# Altium project fleischerTow.PrjPCB
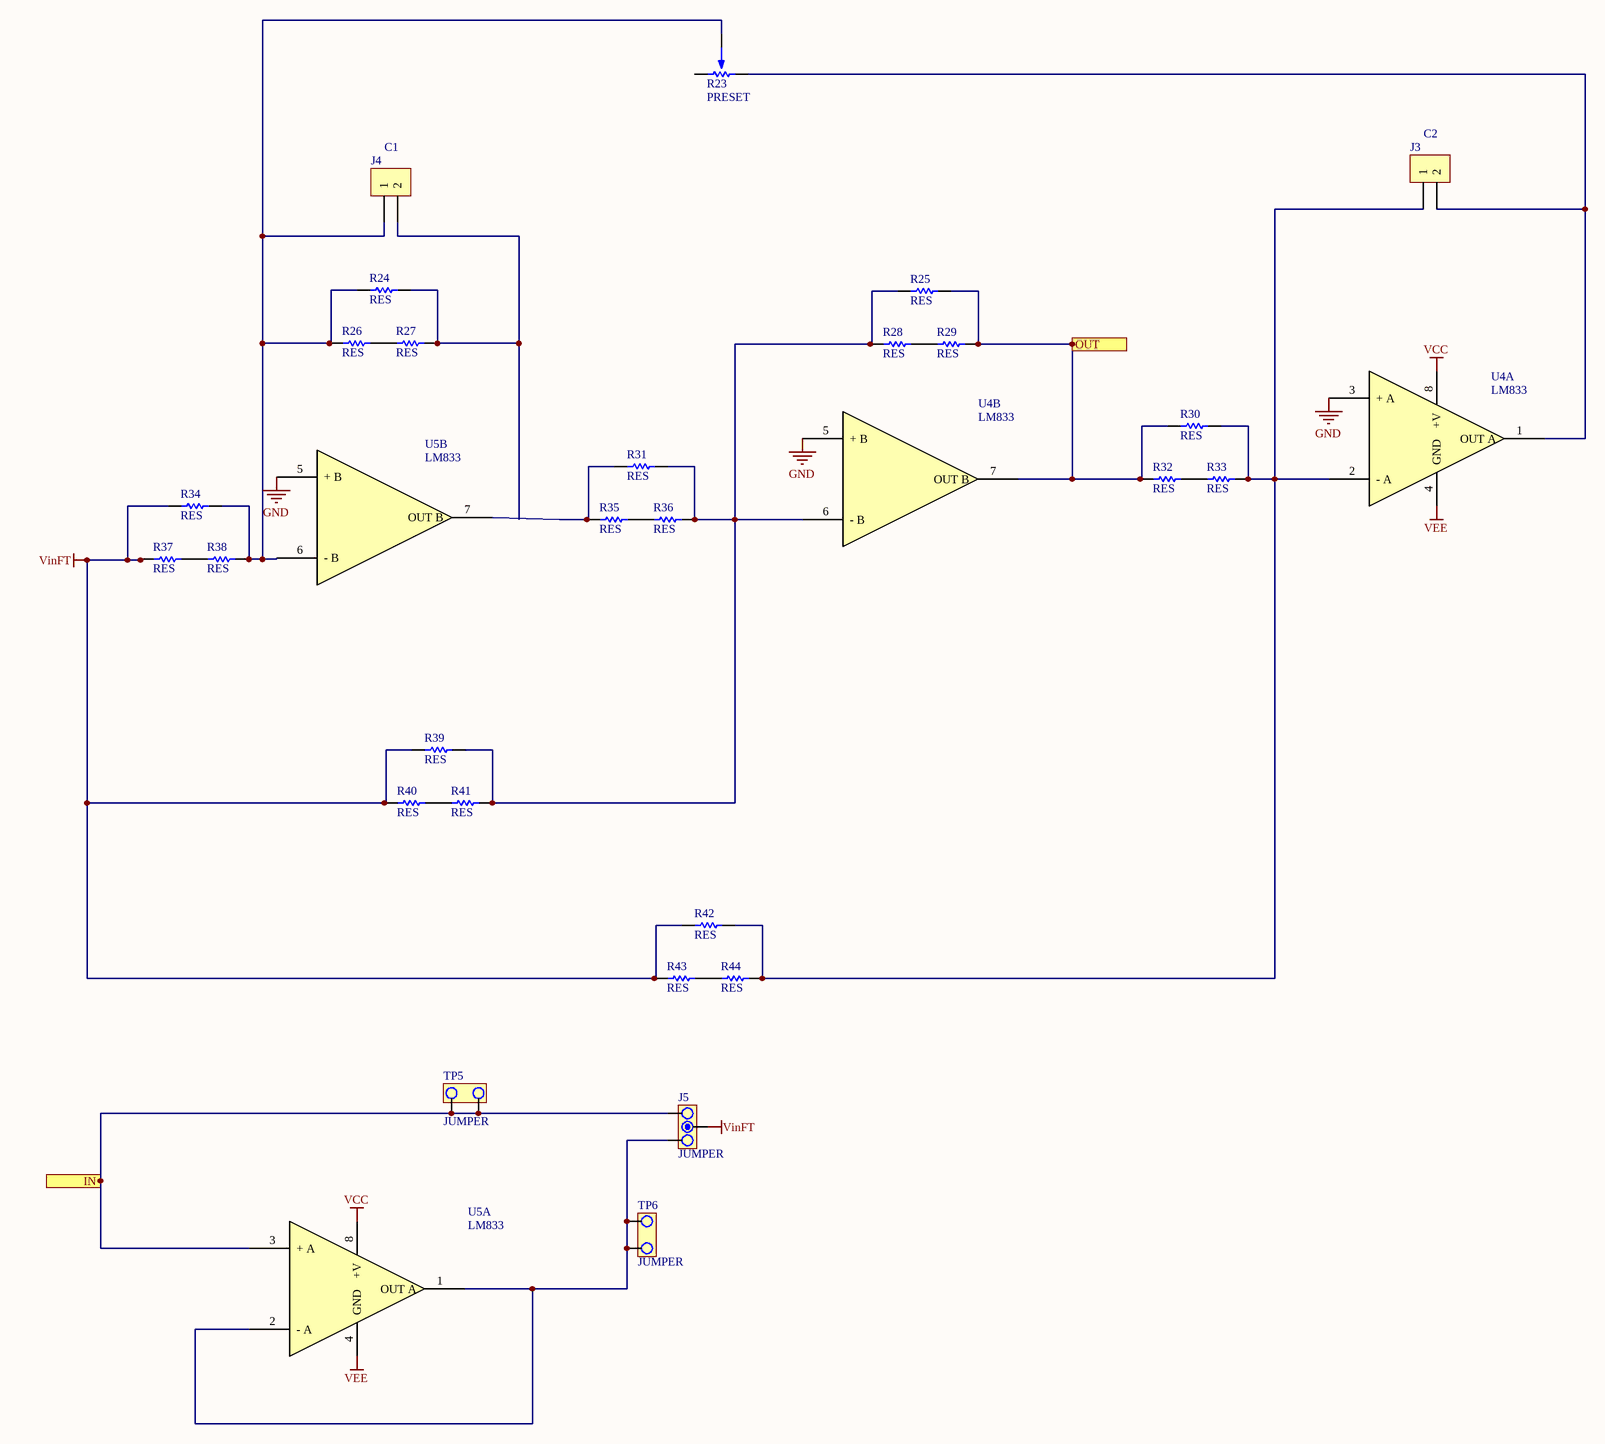
[diagram p0: fleischerTowR3.SchDoc]
3 sheets, 148 parts. Net scope: hierarchical (ports join the sheet entries above them; power ports are global).
Board file: PCB2.PcbDoc
Sheets:
  fleischerTowR3.SchDoc
  filter.SchDoc
    CELDA 2 = fleischerTowR1.SchDoc
    CELDA 3 = fleischerTowR1.SchDoc
    CELDA 1 = fleischerTowR1.SchDoc

## Sheet fleischerTowR3.SchDoc
size A2

### Parts
J3  C2  [SIP2]
J4  C1  [SIP2]
J5  JUMPER  [JUMPER3]
R23  PRESET  [PRESET H]
R24  RES  [0805]
R25  RES  [0805]
R26  RES  [0805]
R27  RES  [0805]
R28  RES  [0805]
R29  RES  [0805]
R30  RES  [0805]
R31  RES  [0805]
R32  RES  [0805]
R33  RES  [0805]
R34  RES  [0805]
R35  RES  [0805]
R36  RES  [0805]
R37  RES  [0805]
R38  RES  [0805]
R39  RES  [0805]
R40  RES  [0805]
R41  RES  [0805]
R42  RES  [0805]
R43  RES  [0805]
R44  RES  [0805]
TP5  JUMPER  [JUMPER2]
TP6  JUMPER  [JUMPER2]
U4  LM833  [DIP8]  (parts A,B of 2)
U5  LM833  [DIP8]  (parts A,B of 2)

### Ports
IN, OUT

### Nets
GND: U4.3(+_A) U4.5(+_B) U5.5(+_B)
VCC: U4.8(+V) U5.8(+V)
VEE: U4.4(GND) U5.4(GND)
VinFT: J5.2 R34.1 R37.1 R39.1 R40.1 R42.1 R43.1
NetJ3_1: J3.1 R30.2 R33.2 R42.2 R44.2 U4.2(-_A)
NetJ3_2: J3.2 R23.3 U4.1(OUT_A)
NetJ4_1: J4.1 R23.2 R24.1 R26.1 R34.2 R38.2 U5.6(-_B)
NetJ4_2: J4.2 R24.2 R27.2
NetJ5_1: J5.1 TP6.1 TP6.2 U5.1(OUT_A) U5.2(-_A)
NetJ5_3: J5.3 TP5.1 TP5.2 U5.3(+_A) ; port IN
NetR25_1: R25.1 R28.1 R31.2 R36.2 R39.2 R41.2 U4.6(-_B)
NetR25_2: R25.2 R29.2 R30.1 R32.1 U4.7(OUT_B) ; port OUT
NetR26_2: R26.2 R27.1
NetR28_2: R28.2 R29.1
NetR31_1: R31.1 R35.1 U5.7(OUT_B)
NetR32_2: R32.2 R33.1
NetR35_2: R35.2 R36.1
NetR37_2: R37.2 R38.1
NetR40_2: R40.2 R41.1
NetR43_2: R43.2 R44.1

Not connected (* = marked no-connect by the designer): R23 1

### Notes on the sheet
- Title
- Size:
- Date:
- File:
- A2
- Number:
- Time:
- Revision:
- Sheet
- of

### Library data of the parts
J3 J4 = CON2
J5 = JUMPER3
U4 U5 = LM833: Dual Audio Operational Amplifier

## Sheet filter.SchDoc
size A
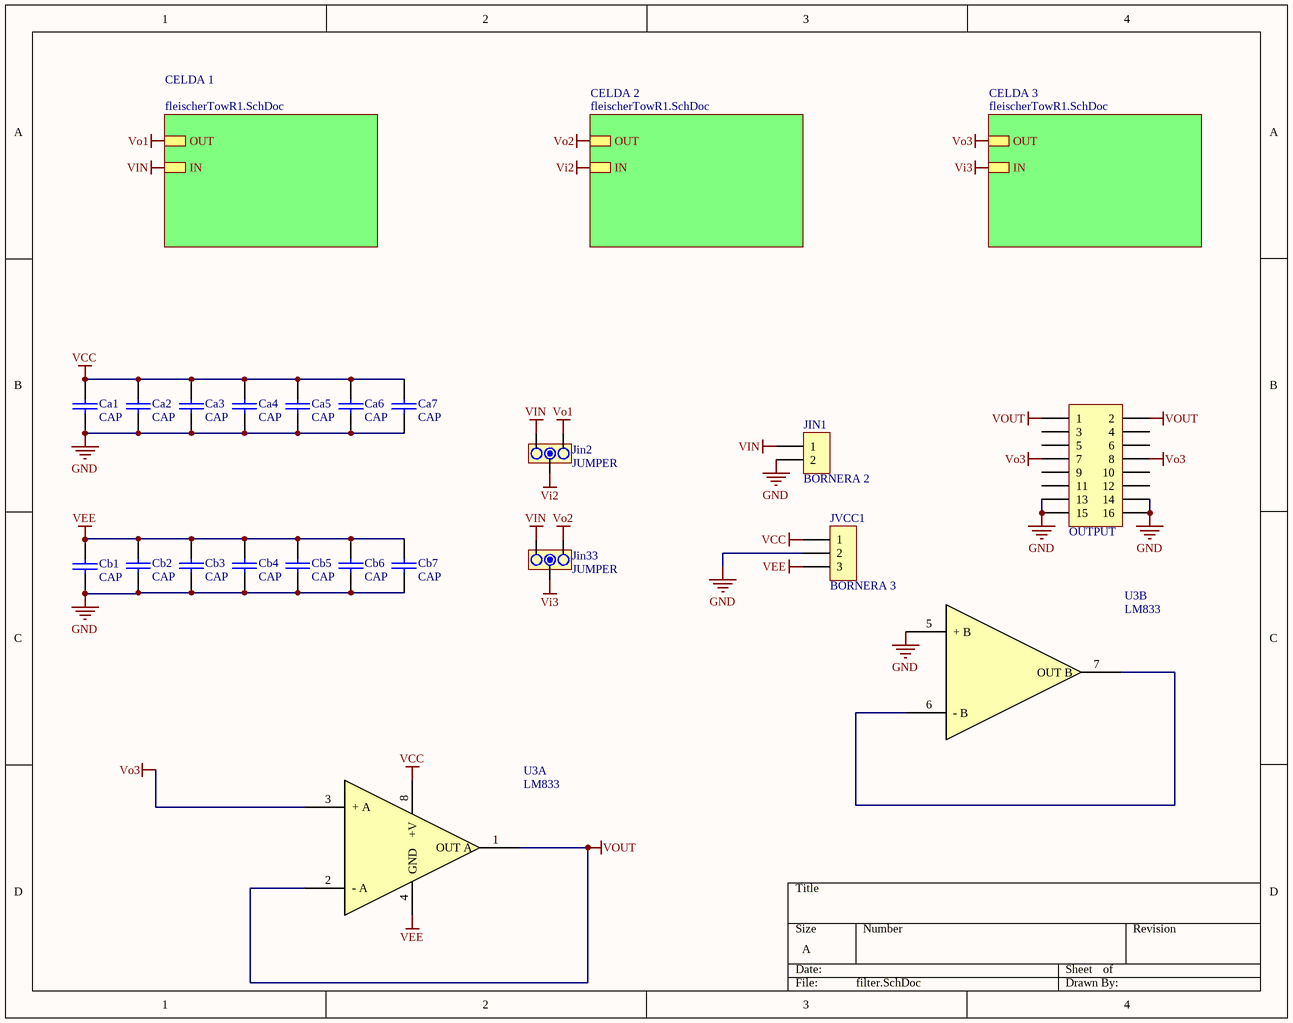
[diagram p1: filter.SchDoc]

### Parts
?  OUTPUT  [SIP8*2]
Ca1  CAP  [CAP200]
Ca2  CAP  [CAP200]
Ca3  CAP  [CAP200]
Ca4  CAP  [CAP200]
Ca5  CAP  [CAP200]
Ca6  CAP  [CAP200]
Ca7  CAP  [CAP200]
Cb1  CAP  [CAP200]
Cb2  CAP  [CAP200]
Cb3  CAP  [CAP200]
Cb4  CAP  [CAP200]
Cb5  CAP  [CAP200]
Cb6  CAP  [CAP200]
Cb7  CAP  [CAP200]
JIN1  BORNERA 2  [BORNERA2]
Jin2  JUMPER  [JUMPER3TH]
Jin33  JUMPER  [JUMPER3TH]
JVCC1  BORNERA 3  [BORNERA3]
U3  LM833  [DIP8]  (parts A,B of 2)

### Sub-sheets
CELDA 1 = fleischerTowR1.SchDoc: OUT, IN
CELDA 2 = fleischerTowR1.SchDoc: OUT, IN
CELDA 3 = fleischerTowR1.SchDoc: OUT, IN

### Nets
GND: ?.13 ?.14 ?.15 ?.16 Ca1.2 Ca2.2 Ca3.2 Ca4.2 Ca5.2 Ca6.2 Ca7.2 Cb1.2 Cb2.2 Cb3.2 Cb4.2 Cb5.2 Cb6.2 Cb7.2 JIN1.2 JVCC1.2 U3.5(+_B)
VCC: Ca1.1 Ca2.1 Ca3.1 Ca4.1 Ca5.1 Ca6.1 Ca7.1 JVCC1.1 U3.8(+V)
VEE: Cb1.1 Cb2.1 Cb3.1 Cb4.1 Cb5.1 Cb6.1 Cb7.1 JVCC1.3 U3.4(GND)
Vi2: Jin2.2 ; sheet CELDA 2/IN
Vi3: Jin33.2 ; sheet CELDA 3/IN
VIN: JIN1.1 Jin2.1 Jin33.1 ; sheet CELDA 1/IN
Vo1: Jin2.3 ; sheet CELDA 1/OUT
Vo2: Jin33.3 ; sheet CELDA 2/OUT
Vo3: ?.7 ?.8 U3.3(+_A) ; sheet CELDA 3/OUT
VOUT: ?.1 ?.2 U3.1(OUT_A) U3.2(-_A)
NetU3_6: U3.6(-_B) U3.7(OUT_B)

Not connected (* = marked no-connect by the designer): ? 3 4 5 6 9 10 11 12

### Library data of the parts
? = CON8*2
Jin2 Jin33 = JUMPER3TH: TIRA DE PINES 1x3
U3 = LM833: Dual Audio Operational Amplifier

## Sheet fleischerTowR1.SchDoc
size A2
Used 3 times, as channels CELDA 2, CELDA 3, CELDA 1. Parts and nets are listed once, with the designators drawn on the sheet.
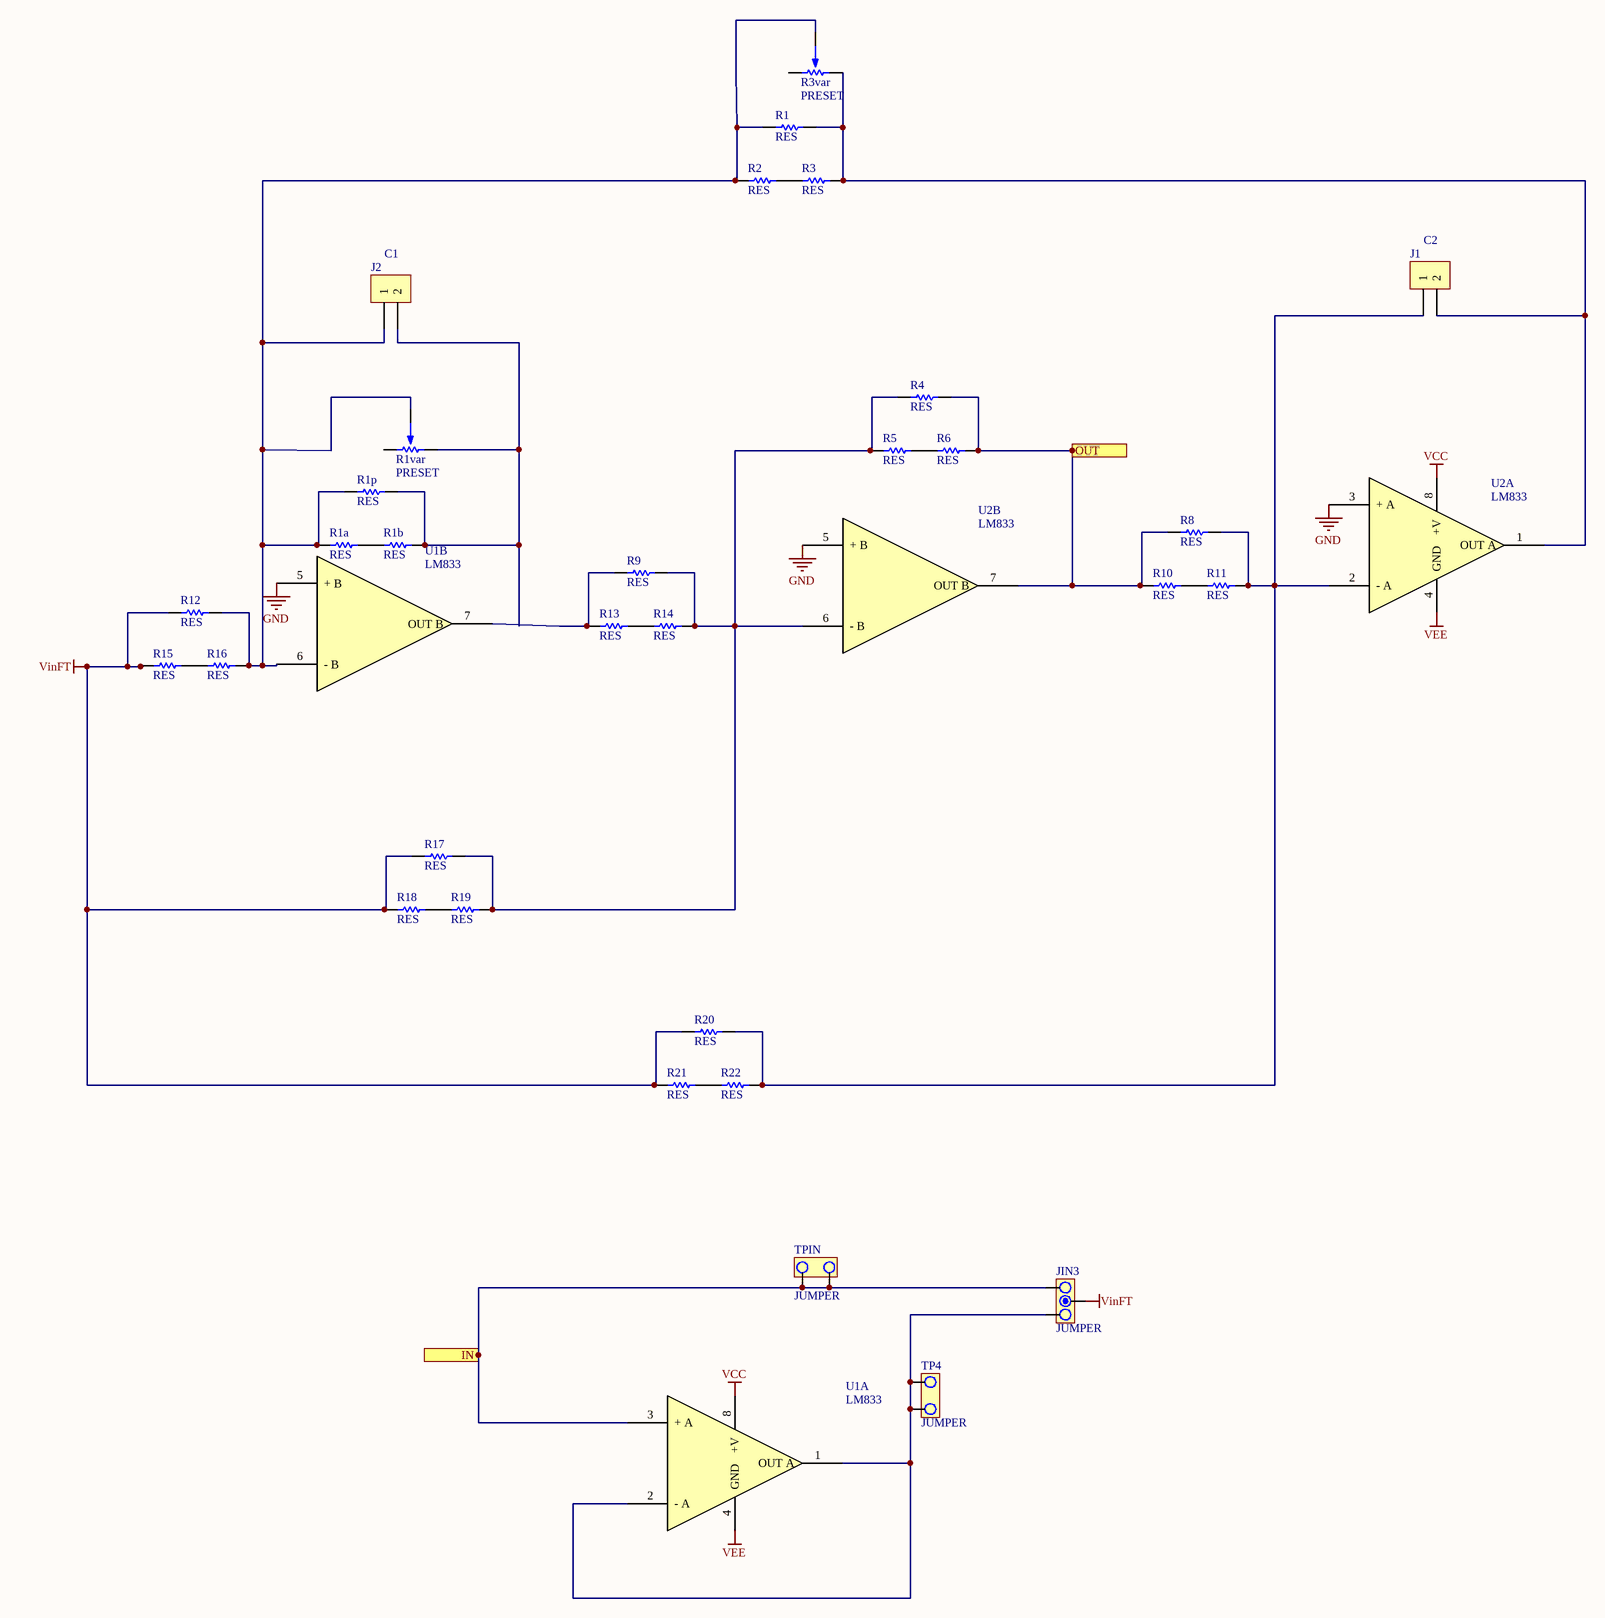
[diagram p2: fleischerTowR1.SchDoc]

### Parts
J1  C2  [SIP2]
J2  C1  [SIP2]
JIN3  JUMPER  [JUMPER3]
R1  RES  [0805]
R1a  RES  [0805]
R1b  RES  [0805]
R1p  RES  [0805]
R1var  PRESET  [PRESET V]
R2  RES  [0805]
R3  RES  [0805]
R3var  PRESET  [PRESET V]
R4  RES  [0805]
R5  RES  [0805]
R6  RES  [0805]
R8  RES  [0805]
R9  RES  [0805]
R10  RES  [0805]
R11  RES  [0805]
R12  RES  [0805]
R13  RES  [0805]
R14  RES  [0805]
R15  RES  [0805]
R16  RES  [0805]
R17  RES  [0805]
R18  RES  [0805]
R19  RES  [0805]
R20  RES  [0805]
R21  RES  [0805]
R22  RES  [0805]
TP4  JUMPER  [JUMPER2]
TPIN  JUMPER  [JUMPER2]
U1  LM833  [DIP8]  (parts A,B of 2)
U2  LM833  [DIP8]  (parts A,B of 2)

### Ports
IN, OUT

### Nets
GND: U1.5(+_B) U2.3(+_A) U2.5(+_B)
VCC: U1.8(+V) U2.8(+V)
VEE: U1.4(GND) U2.4(GND)
VinFT: JIN3.2 R12.1 R15.1 R17.1 R18.1 R20.1 R21.1
IN: JIN3.3 TPIN.1 TPIN.2 U1.3(+_A) ; port IN
OUT: R4.2 R6.2 R8.1 R10.1 U2.7(OUT_B) ; port OUT
NetJ1_1: J1.1 R8.2 R11.2 R20.2 R22.2 U2.2(-_A)
NetJ1_2: J1.2 R1.2 R3.2 R3var.3 U2.1(OUT_A)
NetJ2_1: J2.1 R1.1 R1a.1 R1p.1 R1var.2 R2.1 R3var.2 R12.2 R16.2 U1.6(-_B)
NetJ2_2: J2.2 R1b.2 R1p.2 R1var.3
NetJIN3_1: JIN3.1 TP4.1 TP4.2 U1.1(OUT_A) U1.2(-_A)
NetR1a_2: R1a.2 R1b.1
NetR2_2: R2.2 R3.1
NetR4_1: R4.1 R5.1 R9.2 R14.2 R17.2 R19.2 U2.6(-_B)
NetR5_2: R5.2 R6.1
NetR9_1: R9.1 R13.1 U1.7(OUT_B)
NetR10_2: R10.2 R11.1
NetR13_2: R13.2 R14.1
NetR15_2: R15.2 R16.1
NetR18_2: R18.2 R19.1
NetR21_2: R21.2 R22.1

Not connected (* = marked no-connect by the designer): R1var 1; R3var 1

### Channels
CELDA 2: designators end in _CELDA_2; ports IN=Vi2 OUT=Vo2
CELDA 3: designators end in _CELDA_3; ports IN=Vi3 OUT=Vo3
CELDA 1: designators J1=J1 J2=J2 JIN3=JIN3 R1=R1 R1a=R1a_CELDA_1 R1b=R1b_CELDA_1 R1p=R1p_CELDA_1 R1var=R1var_CELDA_1 R2=R2 R3=R3 R3var=R3var_CELDA_1 R4=R4 R5=R5 R6=R6 R8=R8 R9=R9 R10=R10 R11=R11 R12=R12 R13=R13 R14=R14 R15=R15 R16=R16 R17=R17 R18=R18 R19=R19 R20=R20 R21=R21 R22=R22 TP4=TP4 TPIN=TP3 U1=U1 U2=U2; ports IN=VIN OUT=Vo1

### Notes on the sheet
- Title
- Size:
- Date:
- File:
- A2
- Number:
- Time:
- Revision:
- Sheet
- of

### Library data of the parts
J1 J2 = CON2
JIN3 = JUMPER3
U1 U2 = LM833: Dual Audio Operational Amplifier

## Nets that join several sheets
GND: fleischerTowR3 (U4.3 U4.5 U5.5), filter (21 pins), CELDA 2 (U1_CELDA_2.5 U2_CELDA_2.3 U2_CELDA_2.5), CELDA 3 (U1_CELDA_3.5 U2_CELDA_3.3 U2_CELDA_3.5), CELDA 1 (U1.5 U2.3 U2.5)
VCC: fleischerTowR3 (U4.8 U5.8), filter (9 pins), CELDA 2 (U1_CELDA_2.8 U2_CELDA_2.8), CELDA 3 (U1_CELDA_3.8 U2_CELDA_3.8), CELDA 1 (U1.8 U2.8)
VEE: fleischerTowR3 (U4.4 U5.4), filter (9 pins), CELDA 2 (U1_CELDA_2.4 U2_CELDA_2.4), CELDA 3 (U1_CELDA_3.4 U2_CELDA_3.4), CELDA 1 (U1.4 U2.4)
Vi2: filter (Jin2.2), CELDA 2 (JIN3_CELDA_2.3 TPIN_CELDA_2.1 TPIN_CELDA_2.2 U1_CELDA_2.3)
Vi3: filter (Jin33.2), CELDA 3 (JIN3_CELDA_3.3 TPIN_CELDA_3.1 TPIN_CELDA_3.2 U1_CELDA_3.3)
VIN: filter (JIN1.1 Jin2.1 Jin33.1), CELDA 1 (JIN3.3 TP3.1 TP3.2 U1.3)
VinFT: fleischerTowR3 (7 pins), CELDA 2 (7 pins), CELDA 3 (7 pins), CELDA 1 (7 pins)
Vo1: filter (Jin2.3), CELDA 1 (5 pins)
Vo2: filter (Jin33.3), CELDA 2 (5 pins)
Vo3: filter (?.7 ?.8 U3.3), CELDA 3 (5 pins)